# EAGLE schematic schematicEagle-CORRECTED (EAGLE 7.7.0)
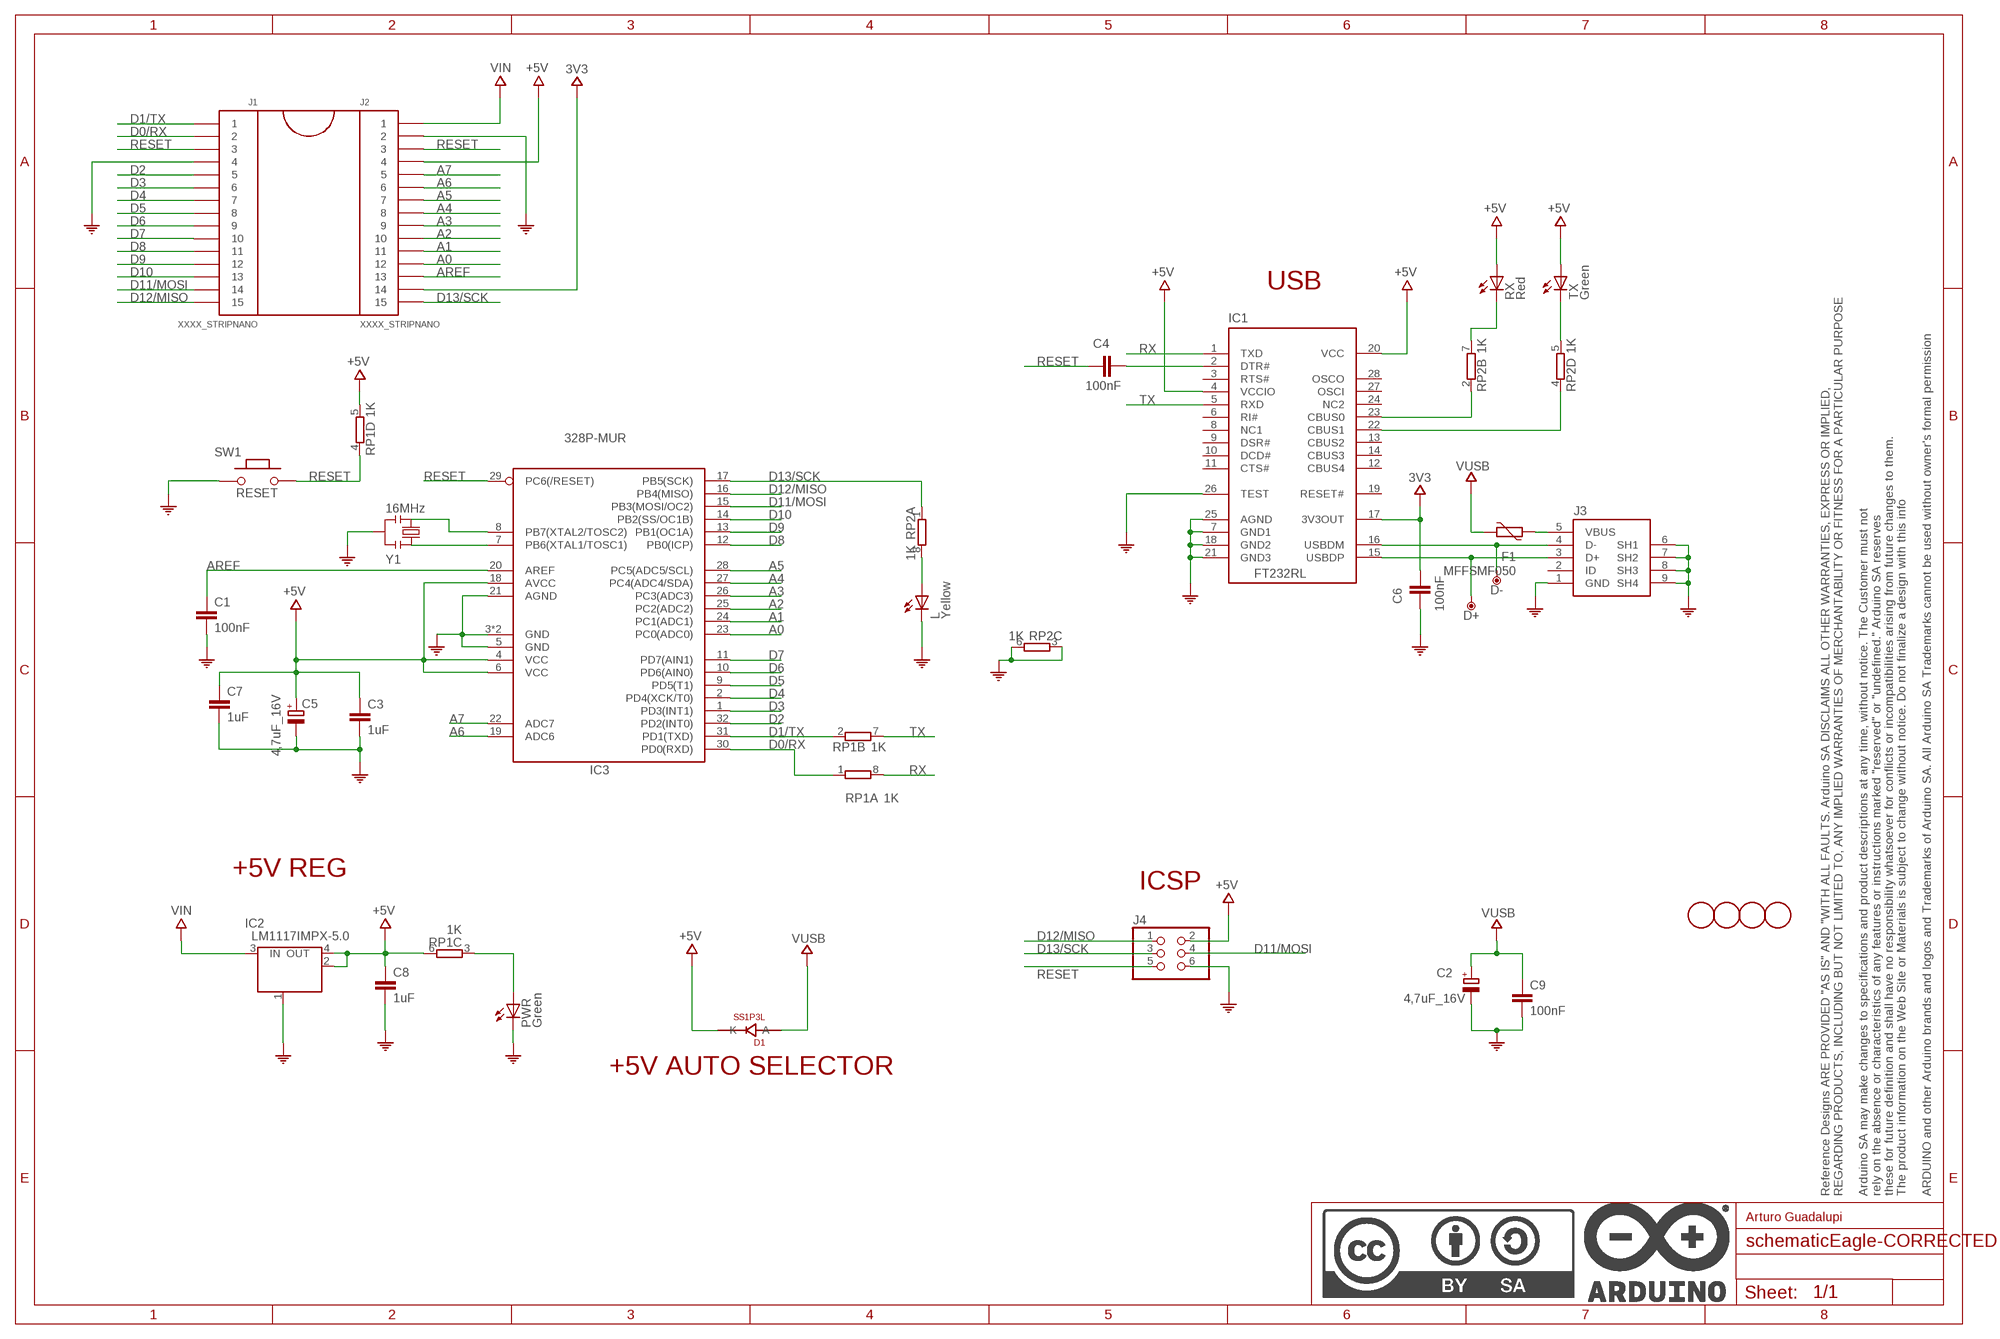
[diagram p0: schematic, sheet 1]

## Parts
C1  100nF  0015_100NF_0603  [C0603-ROUND]
C2  4,7uF_16V  0833_TAJA475MO16RNJ  [TAN-A]
C3  1uF  0006_1UF_0603/GRM188R61E105KA12D  [C0603-ROUND]
C4  100nF  0015_100NF_0603  [C0603-ROUND]
C5  4,7uF_16V  0833_TAJA475MO16RNJ  [TAN-A]
C6  100nF  0015_100NF_0603  [C0603-ROUND]
C7  1uF  0006_1UF_0603/GRM188R61E105KA12D  [C0603-ROUND]
C8  1uF  0006_1UF_0603/GRM188R61E105KA12D  [C0603-ROUND]
C9  100nF  0015_100NF_0603  [C0603-ROUND]
D1  SS1P3L  0025_SS1P3L-M3/84A  [DO220AAL]
D+  DNP  TPTP-1.00MM  [TP-1.00MM]
D-  DNP  TPTP-1.00MM  [TP-1.00MM]
F1  MFFSMF050  PTC  [0603-1608X90N]
FRAME1  DNP  A3-FRAME  [FRAME]
IC1  FT232RL  0226_FT232RL  [SSOP28]
IC2  LM1117IMPX-5.0  0022_LM1117IMPX-5.0  [LINEAR_SOT223]
IC3  328P-MUR  ATMEGA328P-32MUR  [VQFN32]
J1  XXXX_STRIPNANO  [HEAD15-NOSS]
J2  XXXX_STRIPNANO  [HEAD15-NOSS]
J3  0219_14850  [USB-MINI-B_2]
J4  0114_PH254-203DF118A00V  [2X03]
L  Yellow  0044_KPT-2012YC  [CHIPLED_0805]
PWR  Green  0043_KPT-2012SGC  [CHIPLED_0805]
RP1  1K  0005_064R_1K_/_CAY16-102J4LF  [CAY16]
RP2  1K  0005_064R_1K_/_CAY16-102J4LF  [CAY16]
RX  Red  0181_KTP-2012SURCK  [CHIPLED_0805]
SW1  RESET  0173_IT-1185AP1C-160G-G_T&R  [SMD_157SW]
TX  Green  0043_KPT-2012SGC  [CHIPLED_0805]
U$4  DNP  FIDUCIAL-1.5MM  [FD-1-1.5]
U$5  DNP  FIDUCIAL-1.5MM  [FD-1-1.5]
U$53  DNP  FIDUCIAL-1.5MM  [FD-1-1.5]
U$54  DNP  FIDUCIAL-1.5MM  [FD-1-1.5]
Y1  16MHz  0011_CSTCE16M0V53-R0  [RESONATOR]

## Nets
3V3: C6.2 IC1.17(3V3OUT) J2.14
+5V: C3.1 C5.1(+) C7.1 C8.1 D1.P$1(K) IC1.4(VCCIO) IC1.20(VCC) IC2.2(OUT) IC2.4(OUT) IC3.4(VCC) IC3.6(VCC) IC3.18(AVCC) J2.4 J4.2 RP1.5 RP1.6 RX.A TX.A
A0: IC3.23(PC0(ADC0)) J2.12
A1: IC3.24(PC1(ADC1)) J2.11
A2: IC3.25(PC2(ADC2)) J2.10
A3: IC3.26(PC3(ADC3)) J2.9
A4: IC3.27(PC4(ADC4/SDA)) J2.8
A5: IC3.28(PC5(ADC5/SCL)) J2.7
A6: IC3.19(ADC6) J2.6
A7: IC3.22(ADC7) J2.5
AREF: C1.1 IC3.20(AREF) J2.13
COM: C1.2 C2.2(-) C3.2 C5.2(-) C6.1 C7.2 C8.2 C9.2 IC1.7(GND1) IC1.18(GND2) IC1.21(GND3) IC1.25(AGND) IC1.26(TEST) IC2.1(GND/ADJ) IC3.3(GND) IC3.5(GND) IC3.21(AGND) IC3.33(GND) J1.4 J2.2 J3.1(GND) J3.6(SH1) J3.7(SH2) J3.8(SH3) J3.9(SH4) J4.6 L.C PWR.C RP2.3 RP2.6 SW1.1 Y1.2
D0/RX: IC3.30(PD0(RXD)) J1.2 RP1.1
D1/TX: IC3.31(PD1(TXD)) J1.1 RP1.2
D2: IC3.32(PD2(INT0)) J1.5
D3: IC3.1(PD3(INT1)) J1.6
D4: IC3.2(PD4(XCK/T0)) J1.7
D5: IC3.9(PD5(T1)) J1.8
D6: IC3.10(PD6(AIN0)) J1.9
D7: IC3.11(PD7(AIN1)) J1.10
D8: IC3.12(PB0(ICP)) J1.11
D9: IC3.13(PB1(OC1A)) J1.12
D10: IC3.14(PB2(SS/OC1B)) J1.13
D11/MOSI: IC3.15(PB3(MOSI/OC2)) J1.14 J4.4
D12/MISO: IC3.16(PB4(MISO)) J1.15 J4.1
D13/SCK: IC3.17(PB5(SCK)) J2.15 J4.3 RP2.1
N$1: IC3.8(PB7(XTAL2/TOSC2)) Y1.3
N$2: IC3.7(PB6(XTAL1/TOSC1)) Y1.1
N$3: PWR.A RP1.3
N$4: C4.2 IC1.2(DTR#)
N$5: D+.X IC1.15(USBDP) J3.3(D+)
N$6: D-.X IC1.16(USBDM) J3.4(D-)
N$7: L.A RP2.8
N$8: IC1.23(CBUS0) RP2.2
N$9: IC1.22(CBUS1) RP2.4
N$11: RP2.5 TX.C
N$26: F1.2 J3.5(VBUS)
N$29: RP2.7 RX.C
RESET: C4.1 IC3.29(PC6(/RESET)) J1.3 J2.3 J4.5 RP1.4 SW1.2
RX: IC1.1(TXD) RP1.8
TX: IC1.5(RXD) RP1.7
VIN: IC2.3(IN) J2.1
VUSB: C2.1(+) C9.1 D1.P$2(A) F1.1
Unconnected: IC1.3(RTS#) IC1.6(RI#) IC1.8(NC1) IC1.9(DSR#) IC1.10(DCD#) IC1.11(CTS#) IC1.12(CBUS4) IC1.13(CBUS2) IC1.14(CBUS3) IC1.19(RESET#) IC1.24(NC2) IC1.27(OSCI) IC1.28(OSCO) J3.2(ID)

## Notes on the sheet
- USB
- +5V REG
- ICSP
- +5V AUTO SELECTOR
- Arturo Guadalupi

## Library data of the parts
C1 C4 C6 C9 = Condensatori:0015_100NF_0603: 100nF 0603 50V; CASE: 0603; MONTHLY_USAGE: _____; PART_NUMBER: cl10b104kbnc; PRICE: _____; SUPPLIER: _____; TYPE: Condensatori
C2 C5 = Condensatori:0833_TAJA475MO16RNJ: 4,7uF; CASE: Case_A_(1206); MONTHLY_USAGE: _____; PART_NUMBER: TAJA475MO16RNJ; PRICE: _____; SUPPLIER: _____; TYPE: Condensatori
C3 C7 C8 = Condensatori:0006_1UF_0603/GRM188R61E105KA12D: 1uF 0603; CASE: 0603; MONTHLY_USAGE: _____; PART_NUMBER: 1uF_0603/GRM188R61E105KA12D; PRICE: _____; SUPPLIER: _____; TYPE: Condensatori
D1 = Diodi:0025_SS1P3L-M3/84A: 1A 30V Schottky Barrier Rectifiers -SS1P3L-M3/84A; CASE: SMP; MONTHLY_USAGE: _____; PART_NUMBER: SS1P3L-M3/84A; PRICE: _____; SUPPLIER: _____; TYPE: Diodi
D+ D- = Arduino-utility:TP: Testpoint; DATASHEET: DNP; DISTRIBUTOR-LINK: DNP; DISTRIBUTOR-PN: DNP; MANUFACTURER: DNP; MANUFACTURER-PN: DNP
F1 = Arduino-rcl:PTC: SMD PTC; DATASHEET: http://www.bourns.com/docs/Product-Datasheets/mffsmf.pdf; DISTRIBUTOR-LINK: http://www.digikey.com/product-detail/en/bourns-inc/MF-FSMF050X-2/MF-FSMF050X-2CT-ND/2039389; DISTRIBUTOR-PN: MF-FSMF050X-2CT-ND; MANUFACTURER: Bourns Inc; MANUFACTURER-PN: MF-FSMF050X-2
FRAME1 = Arduino-utility:A3-FRAME; CODE-ARDUINO: DNP; DATASHEET: DNP; DISTRIBUTOR-LINK: DNP; DISTRIBUTOR-PN: DNP; MANUFACTURER: DNP; MANUFACTURER-PN: DNP; NOTE: DNP
IC1 = IntegratedCircuits:0226_FT232RL: USB to serial UART interface -FT232RL; CASE: SSOP28; MONTHLY_USAGE: _____; PART_NUMBER: FT232RL; PRICE: _____; SUPPLIER: _____; TYPE: Circuito_Integrato
IC2 = IntegratedCircuits:0022_LM1117IMPX-5.0: Low-dropout linear regulator 5V -LM1117IMPX-5.0; CASE: SOT223; MONTHLY_USAGE: _____; PART_NUMBER: LM1117IMPX-5.0; PRICE: _____; SUPPLIER: _____; TYPE: Circuito_Integrato
IC3 = Arduino-ucs&SoCs:ATMEGA328P-32: 8-bit Microcontroller with 32KBytes In-System Programmable Flash ATMEGA328P-AU; DATASHEET: http://www.atmel.com/images/Atmel-8271-8-bit-AVR-Microcontroller-ATmega48A-48PA-88A-88PA-168A-168PA-328-328P_datasheet_Complete.pdf; DISTRIBUTOR-LINK: https://www.digikey.it/product-detail/it/microchip-technology/ATMEGA328P-MUR/ATMEGA328P-MURCT-ND/3440953; DISTRIBUTOR-PN: ATMEGA328P-MURCT-ND; MANUFACTURER: ATMEL; MANUFACTURER-PN: ATMEGA328P-MUR
J1 J2 = Connettori:XXXX_STRIPNANO: Strip passo 2,54 a 15 pin per Arduino Nano; VALUE: Strip15pin
J3 = Connettori:0219_14850: Usb-Mini F 90 Smd; MONTHLY_USAGE: _____; PART_NUMBER: 14850; PRICE: _____; SUPPLIER: _____; TYPE: Connettori; VALUE: USB-mini-90 -SMD
J4 = Connettori:0114_PH254-203DF118A00V: 3x2 M V h 8,5 mm p2,54; MONTHLY_USAGE: _____; PART_NUMBER: PH254-203DF118A00V; PRICE: _____; SUPPLIER: _____; TYPE: Connettori; VALUE: ICSP
L = Opto:0044_KPT-2012YC: LED YELLOW - SMD - 0805; MONTHLY_USAGE: _____; PART_NUMBER: KPT-2012YC; PRICE: _____; SUPPLIER: _____; TYPE: Opto
PWR TX = Opto:0043_KPT-2012SGC: LED GREEN - SMD-0805; MONTHLY_USAGE: _____; PART_NUMBER: KPT-2012SGC; PRICE: _____; SUPPLIER: _____; TYPE: Opto
RP1 RP2 = Resistenze:0005_064R_1K_/_CAY16-102J4LF: 1K 064R; CASE: SMD_3,2x1,6; MONTHLY_USAGE: _____; PART_NUMBER: 064R_1K_/_CAY16-102J4LF; PRICE: _____; SUPPLIER: _____; TYPE: Resistenze
RX = Opto:0181_KTP-2012SURCK: LED RED - SMD - 0805; MONTHLY_USAGE: _____; PART_NUMBER: KTP-2012SURCK; PRICE: _____; SUPPLIER: _____; TYPE: Opto
SW1 = Switches:0173_IT-1185AP1C-160G-G_T&R: Pushbutton 4x3 SMD H2,5mm; MONTHLY_USAGE: _____; PART_NUMBER: IT-1185AP1C-160G-G_T&R; PRICE: _____; SUPPLIER: _____; TYPE: Switches; VALUE: 157SW
U$4 U$5 U$53 U$54 = Arduino-utility:FIDUCIAL: Fiducial mount; DATASHEET: DNP; DISTRIBUTOR-LINK: DNP; DISTRIBUTOR-PN: DNP; MANUFACTURER: DNP; MANUFACTURER-PN: DNP
Y1 = Cristalli:0011_CSTCE16M0V53-R0: 16Mhz - SMD; MONTHLY_USAGE: _____; PART_NUMBER: CSTCE16M0V53-R0; PRICE: _____; SUPPLIER: _____; TYPE: Cristalli; VALUE: CSTCE16M0V53-R0